# EAGLE schematic pr0board_key (EAGLE 9.6.2)
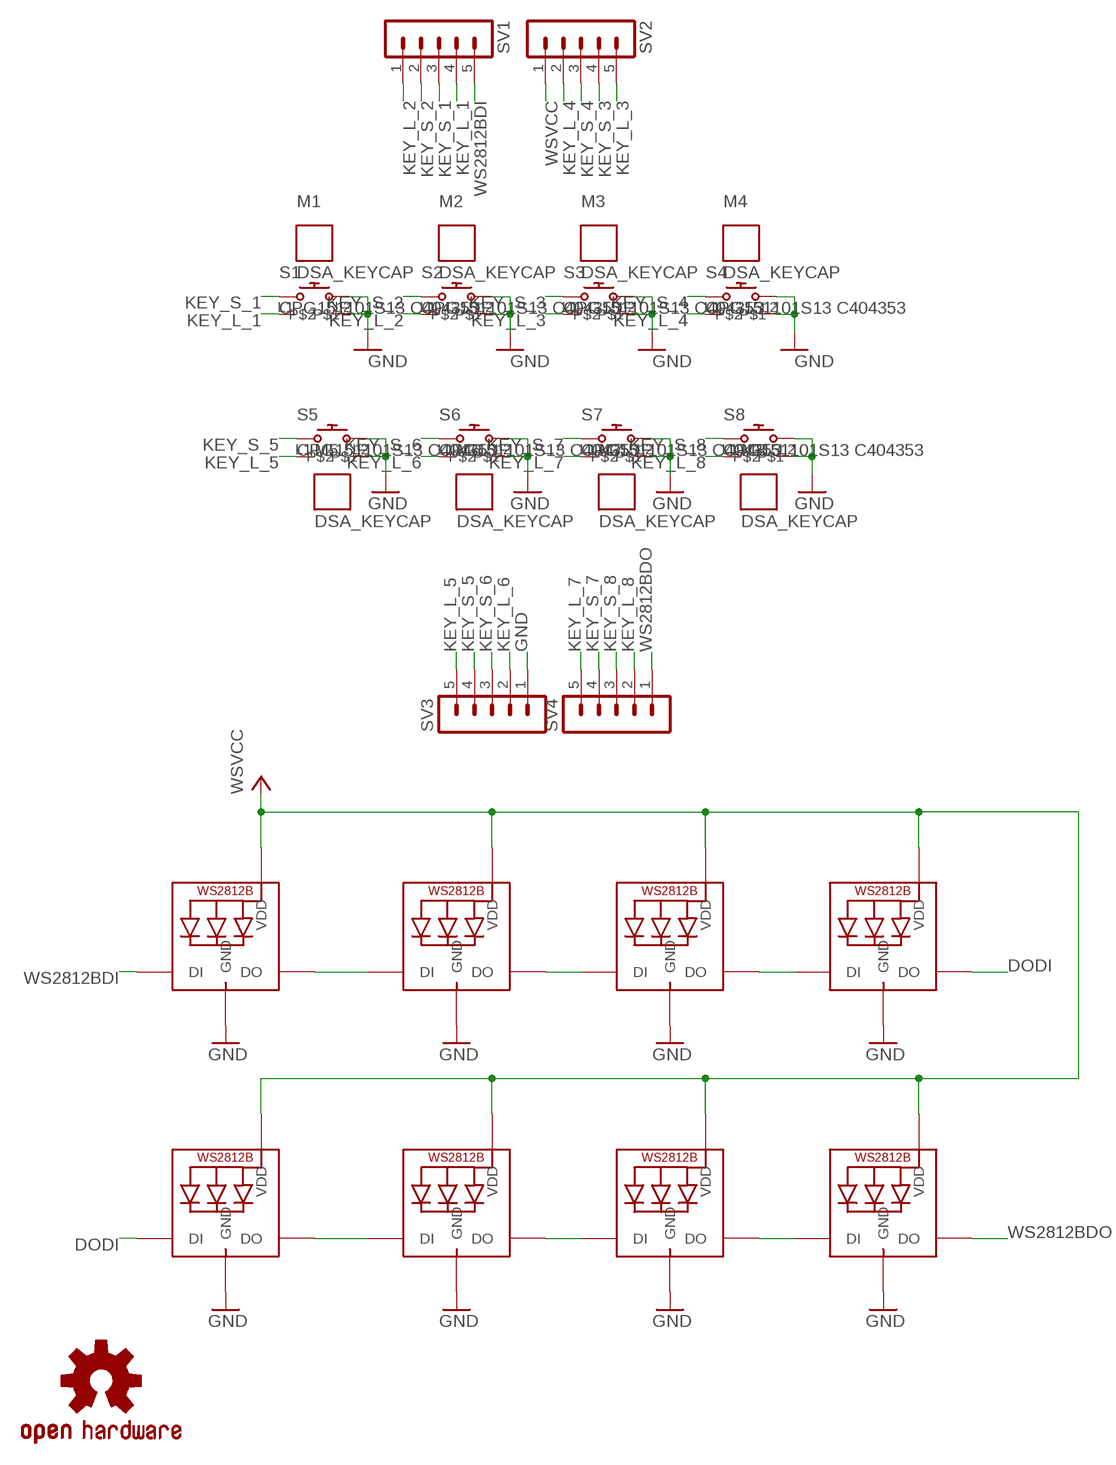
[diagram p0: schematic, sheet 1]

## Parts
LED4  WS2812B3535  [LED3535]
LED5  WS2812B3535  [LED3535]
LED6  WS2812B3535  [LED3535]
LED7  WS2812B3535  [LED3535]
LED8  WS2812B3535  [LED3535]
LED9  WS2812B3535  [LED3535]
LED10  WS2812B3535  [LED3535]
LED11  WS2812B3535  [LED3535]
M1  DSA_KEYCAP  [DSA_KEYCAP]
M2  DSA_KEYCAP  [DSA_KEYCAP]
M3  DSA_KEYCAP  [DSA_KEYCAP]
M4  DSA_KEYCAP  [DSA_KEYCAP]
M5  DSA_KEYCAP  [DSA_KEYCAP]
M6  DSA_KEYCAP  [DSA_KEYCAP]
M7  DSA_KEYCAP  [DSA_KEYCAP]
M8  DSA_KEYCAP  [DSA_KEYCAP]
S1  CPG151101S13 C404353  CHERRY_MX_LED  [CHERRY_MX_LED]
S2  CPG151101S13 C404353  CHERRY_MX_LED  [CHERRY_MX_LED]
S3  CPG151101S13 C404353  CHERRY_MX_LED  [CHERRY_MX_LED]
S4  CPG151101S13 C404353  CHERRY_MX_LED  [CHERRY_MX_LED]
S5  CPG151101S13 C404353  CHERRY_MX_LED  [CHERRY_MX_LED]
S6  CPG151101S13 C404353  CHERRY_MX_LED  [CHERRY_MX_LED]
S7  CPG151101S13 C404353  CHERRY_MX_LED  [CHERRY_MX_LED]
S8  CPG151101S13 C404353  CHERRY_MX_LED  [CHERRY_MX_LED]
SV1  MA05-1  [MA05-1]
SV2  MA05-1  [MA05-1]
SV3  MA05-1  [MA05-1]
SV4  MA05-1  [MA05-1]
U$1  OSHW-LOGOS  [OSHW-LOGO-S]

## Nets
DODI: LED7.2(DO) LED8.4(DI)
GND: LED4.3(GND) LED5.3(GND) LED6.3(GND) LED7.3(GND) LED8.3(GND) LED9.3(GND) LED10.3(GND) LED11.3(GND) S1.L2 S1.S2 S2.L2 S2.S2 S3.L2 S3.S2 S4.L2 S4.S2 S5.L2 S5.S2 S6.L2 S6.S2 S7.L2 S7.S2 S8.L2 S8.S2 SV3.1
KEY_L_1: S1.L1 SV1.4
KEY_L_2: S2.L1 SV1.1
KEY_L_3: S3.L1 SV2.5
KEY_L_4: S4.L1 SV2.2
KEY_L_5: S5.L1 SV3.5
KEY_L_6: S6.L1 SV3.2
KEY_L_7: S7.L1 SV4.5
KEY_L_8: S8.L1 SV4.2
KEY_S_1: S1.S1 SV1.3
KEY_S_2: S2.S1 SV1.2
KEY_S_3: S3.S1 SV2.4
KEY_S_4: S4.S1 SV2.3
KEY_S_5: S5.S1 SV3.4
KEY_S_6: S6.S1 SV3.3
KEY_S_7: S7.S1 SV4.4
KEY_S_8: S8.S1 SV4.3
N$8: LED4.2(DO) LED5.4(DI)
N$9: LED5.2(DO) LED6.4(DI)
N$10: LED6.2(DO) LED7.4(DI)
N$13: LED8.2(DO) LED9.4(DI)
N$14: LED9.2(DO) LED10.4(DI)
N$15: LED10.2(DO) LED11.4(DI)
WS2812BDI: LED4.4(DI) SV1.5
WS2812BDO: LED11.2(DO) SV4.1
WSVCC: LED4.1(VDD) LED5.1(VDD) LED6.1(VDD) LED7.1(VDD) LED8.1(VDD) LED9.1(VDD) LED10.1(VDD) LED11.1(VDD) SV2.1

## Library data of the parts
LED4-LED11 = adafruit:WS2812B
M1-M8 = cherry:DSA_KEYCAP: DSA keycap
S1-S8 = cherry:CHERRY_MX_LED: Cherry MX with LED; FARNELL: 2292961; MOUSER: 540_MX1A_11NW
SV1-SV4 = con-lstb:MA05-1: PIN HEADER; OC_FARNELL: unknown; OC_NEWARK: unknown
U$1 = SparkFun:OSHW-LOGO: Open Source Hardware Logo This logo indicates the piece of hardware it is found on incorporates a OSHW license and/or adheres to the definition of open source hardware found here: http://freedomdefined.org/OSHW